# EAGLE design Soldering Iron Light Schematic (EAGLE 6.5.0)
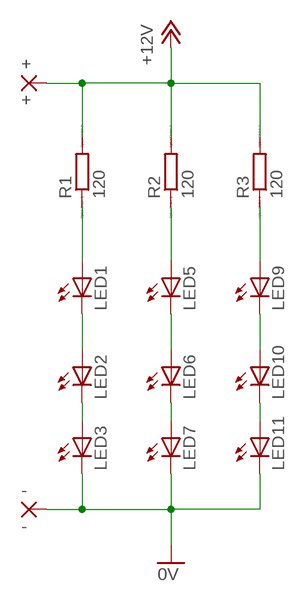
[diagram p0: schematic, sheet 1]

## Parts
+  +  SMD2  [SMD1,27-2,54]
-  -  SMD2  [SMD1,27-2,54]
LED1  LEDCHIPLED_1206  [CHIPLED_1206]
LED2  LEDCHIPLED_1206  [CHIPLED_1206]
LED3  LEDCHIPLED_1206  [CHIPLED_1206]
LED5  LEDCHIPLED_1206  [CHIPLED_1206]
LED6  LEDCHIPLED_1206  [CHIPLED_1206]
LED7  LEDCHIPLED_1206  [CHIPLED_1206]
LED9  LEDCHIPLED_1206  [CHIPLED_1206]
LED10  LEDCHIPLED_1206  [CHIPLED_1206]
LED11  LEDCHIPLED_1206  [CHIPLED_1206]
R1  120  R  [R0805]
R2  120  R  [R0805]
R3  120  R  [R0805]

## Nets
+12V: +.1(P) R1.2 R2.2 R3.2
GND: -.1(P) LED3.C LED7.C LED11.C ; supply symbol labelled 0V
N$1: LED1.A R1.1
N$2: LED5.C LED6.A
N$3: LED5.A R2.1
N$4: LED1.C LED2.A
N$5: LED9.A R3.1
N$6: LED9.C LED10.A
N$7: LED10.C LED11.A
N$8: LED6.C LED7.A
N$9: LED2.C LED3.A

## Library data of the parts
+ - = wirepad:SMD2: SMD PAD
LED1-LED3 LED5-LED7 LED9-LED11 = led:LED: LED OSRAM: - CHIPLED LG R971, LG N971, LY N971, LG Q971, LY Q971, LO R971, LY R971 LH N974, LH R974 LS Q976, LO Q976, LY Q976 LO Q996 - Hyper CHIPLED LW Q18S LB Q993, LB Q99A, LB R99A - SideLED LS A670, LO A670, LY A670, LG A670, LP A670 LB A673, LV A673, LT A673, LW A673 LH A674 LY A675 LS A676, LA A676, LO A676, LY A676, LW A676 LS A679, LY A679, LG A679 - Hyper Micro SIDELED® LS Y876, LA Y876, LO Y876, LY Y876 LT Y87S - SmartLED LW L88C, LW L88S LB L89C, LB L89S, LG L890 LS L89K, LO L89K, LY L89K LS L896, LA L896, LO L896, LY L896 - TOPLED LS T670, LO T670, LY T670, LG T670, LP T670 LSG T670, LSP T670, LSY T670, LOP T670, LYG T670 LG T671, LOG T671, LSG T671 LB T673, LV T673, LT T673, LW T673 LH T674 LS T676, LA T676, LO T676, LY T676, LB T676, LH T676, LSB T676, LW T676 LB T67C, LV T67C, LT T67C, LS T67K, LO T67K, LY T67K, LW E67C LS E67B, LA E67B, LO E67B, LY E67B, LB E67C, LV E67C, LT E67C LW T67C LS T679, LY T679, LG T679 LS T770, LO T770, LY T770, LG T770, LP T770 LB T773, LV T773, LT T773, LW T773 LH T774 LS E675, LA E675, LY E675, LS T675 LS T776, LA T776, LO T776, LY T776, LB T776 LHGB T686 LT T68C, LB T68C - Hyper Mini TOPLED® LB M676 - Mini TOPLED Santana® LG M470 LS M47K, LO M47K, LY M47K Source: http://www.osram.convergy.de LUXEON: - LUMILED® LXK2-PW12-R00, LXK2-PW12-S00, LXK2-PW14-U00, LXK2-PW14-V00 LXK2-PM12-R00, LXK2-PM12-S00, LXK2-PM14-U00 LXK2-PE12-Q00, LXK2-PE12-R00, LXK2-PE12-S00, LXK2-PE14-T00, LXK2-PE14-U00 LXK2-PB12-K00, LXK2-PB12-L00, LXK2-PB12-M00, LXK2-PB14-N00, LXK2-PB14-P00, LXK2-PB14-Q00 LXK2-PR12-L00, LXK2-PR12-M00, LXK2-PR14-Q00, LXK2-PR14-R00 LXK2-PD12-Q00, LXK2-PD12-R00, LXK2-PD12-S00 LXK2-PH12-R00, LXK2-PH12-S00 LXK2-PL12-P00, LXK2-PL12-Q00, LXK2-PL12-R00 Source: www.luxeon.com KINGBRIGHT: KA-3528ASYC Source: www.kingbright.com
R1-R3 = eagle-ltspice:R: RESISTOR, European symbol; SPICEMODEL: NONE; SPICEPREFIX: R

## Board
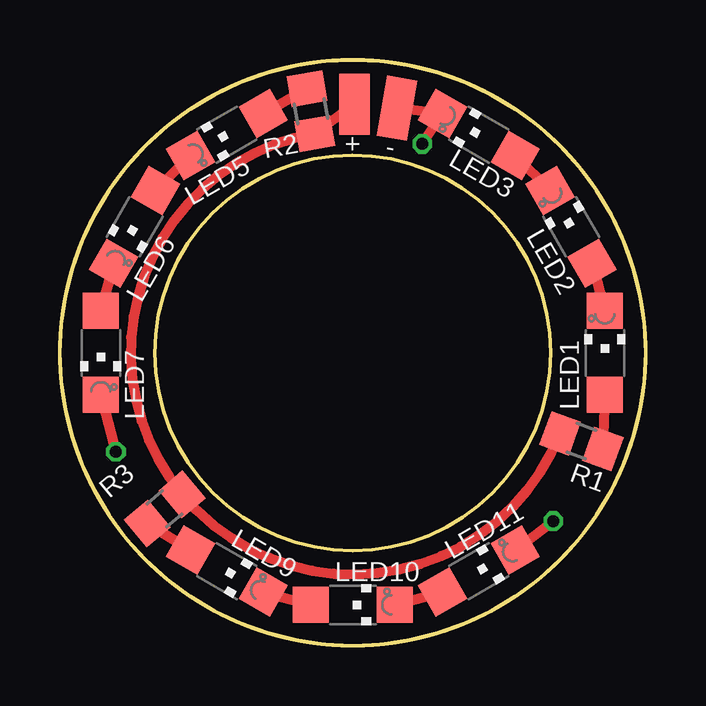
[diagram p1: board, top side]
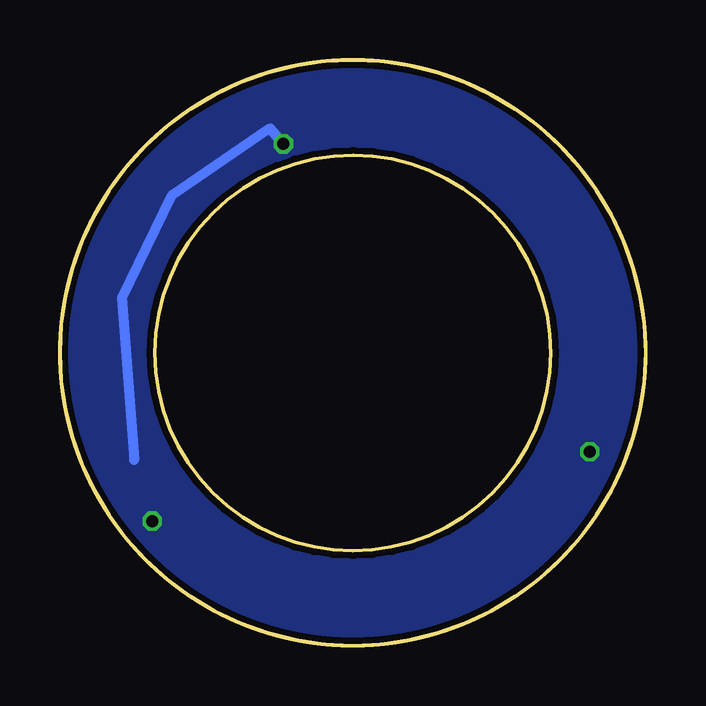
[diagram p2: board, bottom side, seen from below]

Size 24.4 x 24.4 mm. Coordinates in mm from the lower left corner, seen from the top.
Outline: 3.95,12.2 arc180 20.45,12.2 arc180 3.95,12.17
Outline: circle at 12.2,12.2 radius 12.2
Copper layers (1*16): Top 0.035mm / dielectric 1.5mm / Bottom 0.035mm
Design rules "SeeedStudio_2layer_DRU_no_angle_20140221": minimum track width 6mil, minimum drill 12mil, track to track 6mil, track to pad 6mil, pad to pad 6mil, via to via 6mil, smd to smd 0mil, copper to edge 10mil, drill to drill 10mil, minimum pad ring 10mil, minimum via ring 6mil, stop-mask expansion 2mil, vias tented up to drill 100mil, thermal gap 10mil
Milling: 5 lines

### Footprints (pad centres in the part's own frame; a part is rotated, then mirrored left to right if it is on the bottom)
SMD1,27-2,54 = smd 1.27 x 2.54: 1 0,0
CHIPLED_1206 = smd 1.5 x 1.5: A 0,-1.75; C 0,1.75
R0805 = smd 1.3 x 1.5: 1 -0.95,0; 2 0.95,0

### Placement (x,y rotation side)
+  12.27,22.55 0 top
-  14.04,22.39 350 top
LED1  22.7,12.2 0 top
LED2  21.29,17.45 30 top
LED3  17.45,21.29 60 top
LED5  6.95,21.29 120 top
LED6  3.11,17.45 150 top
LED7  1.7,12.2 180 top
LED9  6.95,3.11 240 top
LED10  12.2,1.7 270 top
LED11  17.45,3.11 300 top
R1  21.73,8.52 160 top
R2  10.46,22.27 280 top
R3  4.36,5.69 40 top

### Tracks (layer width: path | path; a pad name or v marks a point on that pad's centre or on a via)
+12V
  Top 0.406: +.1 R2.2 arc120 R3.2 arc119 R1.2
GND  (via drill 0.5)
  Top 0.406: v15.09,20.9 LED3.C -.1 | LED7.C v2.33,8.07 | LED11.C v20.55,5.19
  Bottom 0.406: v15.09,20.9 15.63,21.54 15.73,21.5 19.76,18.74 21.82,14.49 21.31,7.73
  pour Bottom: -3.1,26.62 -3.1,-2.59 30.05,-2.59 30.05,26.62
N$1
  Top 0.406: LED1.A R1.1
N$2
  Top 0.406: LED5.C LED6.A
N$3
  Top 0.406: LED5.A R2.1
N$4
  Top 0.406: LED2.A LED1.C
N$5
  Top 0.406: LED9.A R3.1
N$6
  Top 0.406: LED9.C LED10.A
N$7
  Top 0.406: LED10.C LED11.A
N$8
  Top 0.406: LED6.C LED7.A
N$9
  Top 0.406: LED3.A LED2.C